# Altium schematic sheet DcLink.SchDoc
size A4; DocumentNumber: 9; SheetNumber: 10; SheetTotal: 15
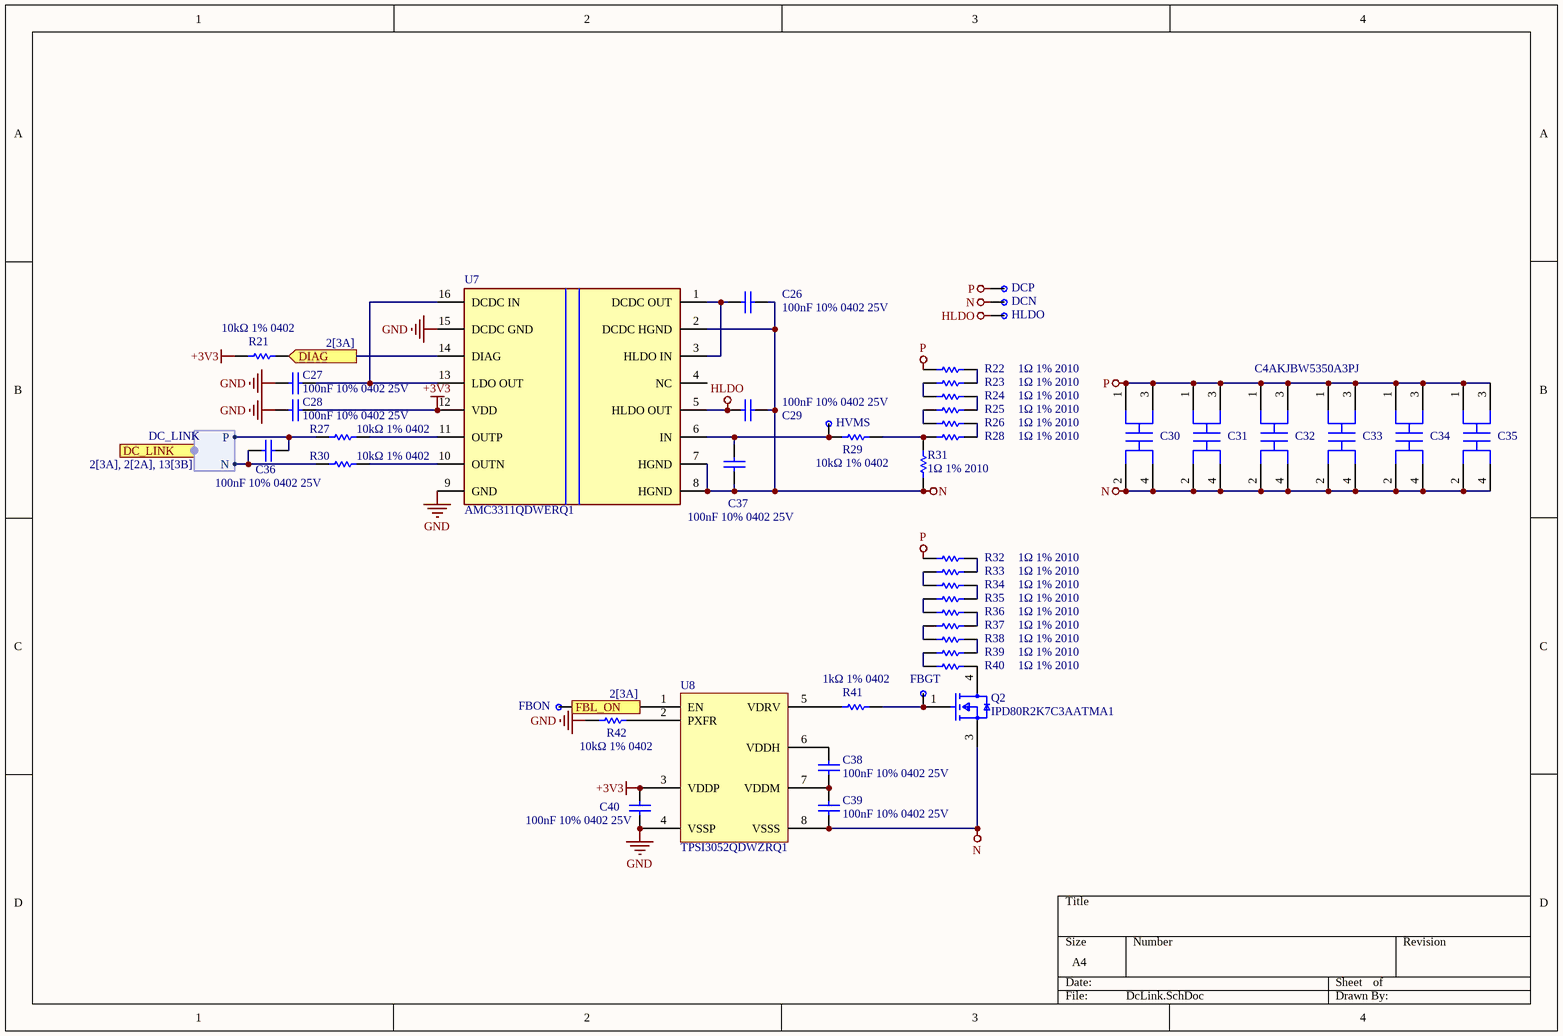
[diagram p0: DcLink.SchDoc]

## Parts
C26  100nF 10% 0402 25V  [0402N]
C27  100nF 10% 0402 25V  [0402N]
C28  100nF 10% 0402 25V  [0402N]
C29  100nF 10% 0402 25V  [0402N]
C30  C4AKJBW5350A3PJ  [FP-C4BWP-MFG]
C31  C4AKJBW5350A3PJ  [FP-C4BWP-MFG]  (value not drawn)
C32  C4AKJBW5350A3PJ  [FP-C4BWP-MFG]  (value not drawn)
C33  C4AKJBW5350A3PJ  [FP-C4BWP-MFG]  (value not drawn)
C34  C4AKJBW5350A3PJ  [FP-C4BWP-MFG]  (value not drawn)
C35  C4AKJBW5350A3PJ  [FP-C4BWP-MFG]  (value not drawn)
C36  100nF 10% 0402 25V  [0402N]
C37  100nF 10% 0402 25V  [0402N]
C38  100nF 10% 0402 25V  [0402N]
C39  100nF 10% 0402 25V  [0402N]
C40  100nF 10% 0402 25V  [0402N]
DCN  Testpoint  [Testpoint-Footprint-1]  (value not drawn)  (no BOM)
DCP  Testpoint  [Testpoint-Footprint-1]  (value not drawn)  (no BOM)
FBGT  Testpoint  [Testpoint-Footprint-1]  (value not drawn)  (no BOM)
FBON  Testpoint  [Testpoint-Footprint-1]  (value not drawn)  (no BOM)
HLDO  Testpoint  [Testpoint-Footprint-1]  (value not drawn)  (no BOM)
HVMS  Testpoint  [Testpoint-Footprint-1]  (value not drawn)  (no BOM)
Q2  IPD80R2K7C3AATMA1  [FP-PG-TO252-3-MFG]
R21  10kΩ 1% 0402  [0402N]
R22  1Ω 1% 2010  [2010N]
R23  1Ω 1% 2010  [2010N]
R24  1Ω 1% 2010  [2010N]
R25  1Ω 1% 2010  [2010N]
R26  1Ω 1% 2010  [2010N]
R27  10kΩ 1% 0402  [0402N]
R28  1Ω 1% 2010  [2010N]
R29  10kΩ 1% 0402  [0402N]
R30  10kΩ 1% 0402  [0402N]
R31  1Ω 1% 2010  [2010N]
R32  1Ω 1% 2010  [2010N]
R33  1Ω 1% 2010  [2010N]
R34  1Ω 1% 2010  [2010N]
R35  1Ω 1% 2010  [2010N]
R36  1Ω 1% 2010  [2010N]
R37  1Ω 1% 2010  [2010N]
R38  1Ω 1% 2010  [2010N]
R39  1Ω 1% 2010  [2010N]
R40  1Ω 1% 2010  [2010N]
R41  1kΩ 1% 0402  [0402N]
R42  10kΩ 1% 0402  [0402N]
U7  AMC3311QDWERQ1  [FP-DWE0016A-MFG]
U8  TPSI3052QDWZRQ1  [TPSI3052QDWZRQ1-Footprint-1]

## Ports
DC_LINK (out, harness DC_LINK, see 2[3A], 2[2A], 13[3B]), DIAG (out, see 2[3A]), FBL_ON (in, see 2[3A])

## Harnesses
DC_LINK: P, N

## Nets
+3V3: C28.1 C40.2 R21.2 U7.12(VDD) U8.3(VDDP)
GND: C27.2 C28.2 C40.1 R42.1 U7.9(GND) U7.15(DCDC_GND) U8.4(VSSP)
HLDO: C29.2 HLDO.1 U7.5(HLDO_OUT)
N: C26.1 C29.1 C30.2 C30.4 C31.2 C31.4 C32.2 C32.4 C33.2 C33.4 C34.2 C34.4 C35.2 C35.4 C37.1 C39.2 DCN.1 Q2.3(source) R31.1 U7.2(DCDC_HGND) U7.7(HGND) U7.8(HGND) U8.8(VSSS)
P: C30.1 C30.3 C31.1 C31.3 C32.1 C32.3 C33.1 C33.3 C34.1 C34.3 C35.1 C35.3 DCP.1 R22.2 R32.2
DIAG: R21.1 U7.14(DIAG) ; port DIAG
FBL_ON: FBON.1 U8.1(EN) ; port FBL_ON
NetC26_2: C26.2 U7.1(DCDC_OUT) U7.3(HLDO_IN)
NetC27_1: C27.1 U7.13(LDO_OUT) U7.16(DCDC_IN)
NetC36_1: C36.1 R27.1 ; port DC_LINK.P
NetC36_2: C36.2 R30.1 ; port DC_LINK.N
NetC37_2: C37.2 HVMS.1 R29.1 U7.6(IN)
NetC38_1: C38.1 U8.6(VDDH)
NetC38_2: C38.2 C39.1 U8.7(VDDM)
NetFBGT_1: FBGT.1 Q2.1(gate) R41.1
NetQ2_4: Q2.4(drain) R40.1
NetR22_1: R22.1 R23.1
NetR23_2: R23.2 R24.2
NetR24_1: R24.1 R25.1
NetR25_2: R25.2 R26.2
NetR26_1: R26.1 R28.1
NetR27_2: R27.2 U7.11(OUTP)
NetR28_2: R28.2 R29.2 R31.2
NetR30_2: R30.2 U7.10(OUTN)
NetR32_1: R32.1 R33.1
NetR33_2: R33.2 R34.2
NetR34_1: R34.1 R35.1
NetR35_2: R35.2 R36.2
NetR36_1: R36.1 R37.1
NetR37_2: R37.2 R38.2
NetR38_1: R38.1 R39.1
NetR39_2: R39.2 R40.2
NetR41_2: R41.2 U8.5(VDRV)
NetR42_2: R42.2 U8.2(PXFR)

Not connected (* = marked no-connect by the designer): U7 4(NC)

## Library data of the parts
C26-C29 C36-C40 = C0402: Capacitance: 100n; Tolerance: 10; Voltage: 25; Footprint: 0402
C30-C35 = CMP-03022-000060-1: FILM, RADIAL, METALLIZED POLYPRO
DCN DCP FBGT FBON HLDO HVMS = CMP-003-000002-1
Q2 = CMP-32901-001052-1: MOSFET N-CH TO252-3; Drain to Source Voltage (Vdss): 800V; RoHS Compliant: Yes; Lead Free: Contains Lead; Halogen Free: Halogen Free; Series: *; Mount: Surface Mount; Max Dual Supply Voltage: 800V
R21 R27 R29 R30 R42 = R0402: Resistance: 10k; Tolerance: 1; Footprint: 0402
R22-R26 R28 R31-R40 = R2010: Resistance: 1; Tolerance: 1; Footprint: 2010
R41 = R0402: Resistance: 1k; Tolerance: 1; Footprint: 0402
U7 = CMP-00370-143191617-1: AMC3311QDWERQ1 Automotive, 0 to 2-V input, precision reinforced isolated amplifier with integrated DC/DC converter 16-SOIC -40 to 125; Manufacturer Lifecycle Status: ACTIVE; Response Time: 600µs; Bandwidth: 275kHz; Max Junction Temperature (Tj): 150°C; Number of Channels: 1; Input Offset Voltage (Vos): 100µV; Min Supply Voltage: 3V; Max Supply Voltage: 5.5V; Output Current per Channel: 14mA; Input Bias Current: 3.5nA; NexarPartId: 143191617; Width: 7.5mm; Length: 10.3mm; Number of Pins: 16; Max Operating Temperature: 125°C; Ambient Temperature Range High: 125°C; Height: 2.65mm; Thickness: 2.35mm; Min Operating Temperature: -40°C; Lifecycle Status: Production
U8 = CMP-00024-00007-1: Automotive reinforced isolated switch driver with integrated 15-V gate supply 8-SO-MOD -40 to 125